# EAGLE schematic power_strip_monitor_V2 (EAGLE 6.4)

## Sheet 1 of 5: Microcontroller
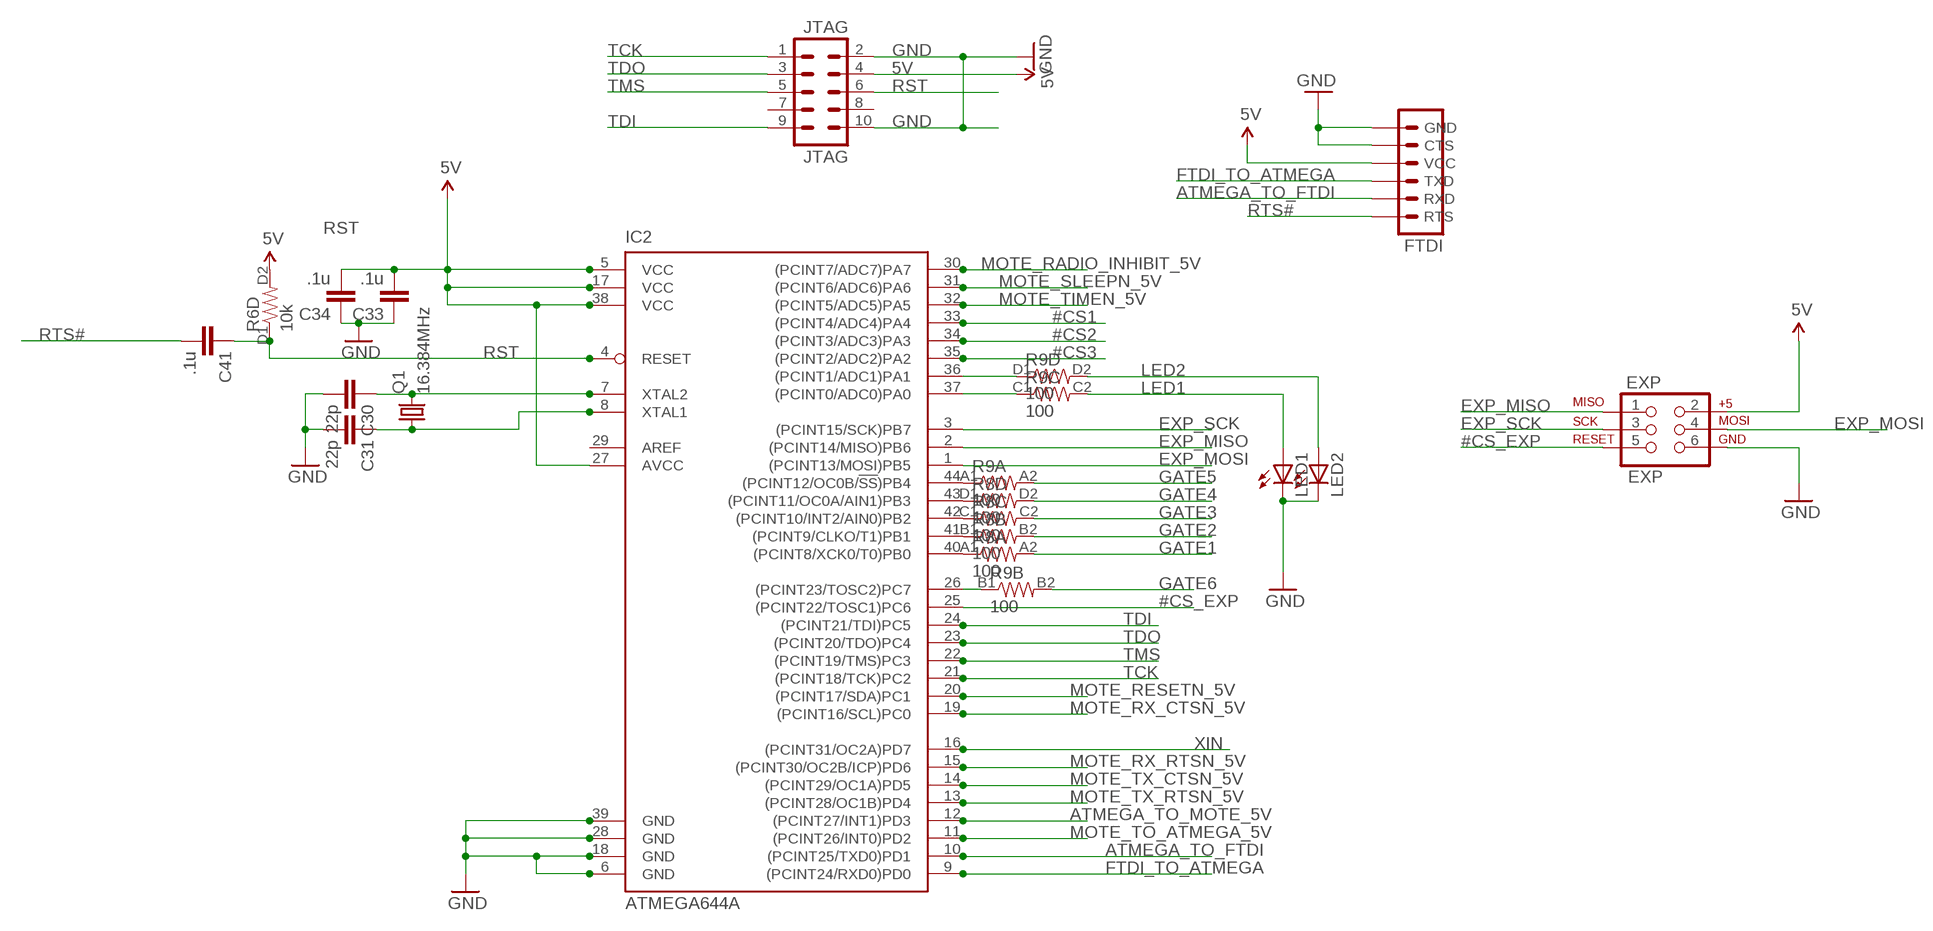
[diagram p0: schematic, sheet 1]

### Parts
C30  22p  CAP0603  [0603]
C31  22p  CAP0603  [0603]
C33  .1u  CAP0603  [0603]
C34  .1u  CAP0603  [0603]
C41  .1u  CAP0603  [0603]
EXP  EXP  AVR_SPI_PRG_6PTH  [2X3]
FTDI  FTDI_CABLESIP  [1X06]
IC2  ATMEGA644A  [TQFP44]
JTAG  JTAG  M05X2PTH  [AVR_ICSP]
LED1  LEDCHIPLED_0805  [CHIPLED_0805]
LED2  LEDCHIPLED_0805  [CHIPLED_0805]
Q1  16.384MHz  CRYSTALSMD  [HC49UP]
R6  10k  RESISTOR-ARRAY  [1206_NETWORK]
R8  100  RESISTOR-ARRAY  [1206_NETWORK]
R9  100  RESISTOR-ARRAY  [1206_NETWORK]

### Nets
5V: C33.2 C34.2 EXP.2 FTDI.3(VCC) IC2.5(VCC) IC2.17(VCC) IC2.27(AVCC) IC2.38(VCC) JTAG.4 R6.D2 ; also sheet 3,5
#CS1: IC2.33((PCINT4/ADC4)PA4) ; also sheet 3
#CS2: IC2.34((PCINT3/ADC3)PA3) ; also sheet 3
#CS3: IC2.35((PCINT2/ADC2)PA2) ; also sheet 3
#CS_EXP: EXP.5 IC2.25((PCINT22/TOSC1)PC6)
ATMEGA_TO_FTDI: FTDI.5(RXD) IC2.10((PCINT25/TXD0)PD1)
ATMEGA_TO_MOTE_5V: IC2.12((PCINT27/INT1)PD3) ; also sheet 5
EXP_MISO: EXP.1 IC2.2((PCINT14/MISO)PB6)
EXP_MOSI: EXP.4 IC2.1((PCINT13/MOSI)PB5)
EXP_SCK: EXP.3 IC2.3((PCINT15/SCK)PB7)
FTDI_TO_ATMEGA: FTDI.4(TXD) IC2.9((PCINT24/RXD0)PD0)
GATE1: R8.A2 ; also sheet 3
GATE2: R8.B2 ; also sheet 3
GATE3: R8.C2 ; also sheet 3
GATE4: R8.D2 ; also sheet 3
GATE5: R9.A2 ; also sheet 3
GATE6: R9.B2 ; also sheet 3
GND: C30.2 C31.2 C33.1 C34.1 EXP.6 FTDI.1(GND) FTDI.2(CTS) IC2.6(GND) IC2.18(GND) IC2.28(GND) IC2.39(GND) JTAG.2 JTAG.10 LED1.C LED2.C ; also sheet 2,3,4,5
LED1: LED1.A R9.C2
LED2: LED2.A R9.D2
MOTE_RADIO_INHIBIT_5V: IC2.30((PCINT7/ADC7)PA7) ; also sheet 5
MOTE_RESETN_5V: IC2.20((PCINT17/SDA)PC1) ; also sheet 5
MOTE_RX_CTSN_5V: IC2.19((PCINT16/SCL)PC0) ; also sheet 5
MOTE_RX_RTSN_5V: IC2.15((PCINT30/OC2B/ICP)PD6) ; also sheet 5
MOTE_SLEEPN_5V: IC2.31((PCINT6/ADC6)PA6) ; also sheet 5
MOTE_TIMEN_5V: IC2.32((PCINT5/ADC5)PA5) ; also sheet 5
MOTE_TO_ATMEGA_5V: IC2.11((PCINT26/INT0)PD2) ; also sheet 5
MOTE_TX_CTSN_5V: IC2.14((PCINT29/OC1A)PD5) ; also sheet 5
MOTE_TX_RTSN_5V: IC2.13((PCINT28/OC1B)PD4) ; also sheet 5
N$1: C30.1 IC2.7(XTAL2) Q1.2
N$3: C31.1 IC2.8(XTAL1) Q1.1
N$6: IC2.40((PCINT8/XCK0/T0)PB0) R8.A1
N$7: IC2.41((PCINT9/CLKO/T1)PB1) R8.B1
N$8: IC2.42((PCINT10/INT2/AIN0)PB2) R8.C1
N$10: IC2.43((PCINT11/OC0A/AIN1)PB3) R8.D1
N$12: IC2.44((PCINT12/OC0B/!SS!)PB4) R9.A1
N$13: IC2.26((PCINT23/TOSC2)PC7) R9.B1
N$14: IC2.36((PCINT1/ADC1)PA1) R9.D1
N$16: IC2.37((PCINT0/ADC0)PA0) R9.C1
RST: C41.1 IC2.4(RESET) JTAG.6 R6.D1
RTS#: C41.2 FTDI.6(RTS)
TCK: IC2.21((PCINT18/TCK)PC2) JTAG.1
TDI: IC2.24((PCINT21/TDI)PC5) JTAG.9
TDO: IC2.23((PCINT20/TDO)PC4) JTAG.3
TMS: IC2.22((PCINT19/TMS)PC3) JTAG.5
XIN: IC2.16((PCINT31/OC2A)PD7) ; also sheet 3
Unconnected: IC2.29(AREF) JTAG.7 JTAG.8

## Sheet 2 of 5: Outlets and Inlets
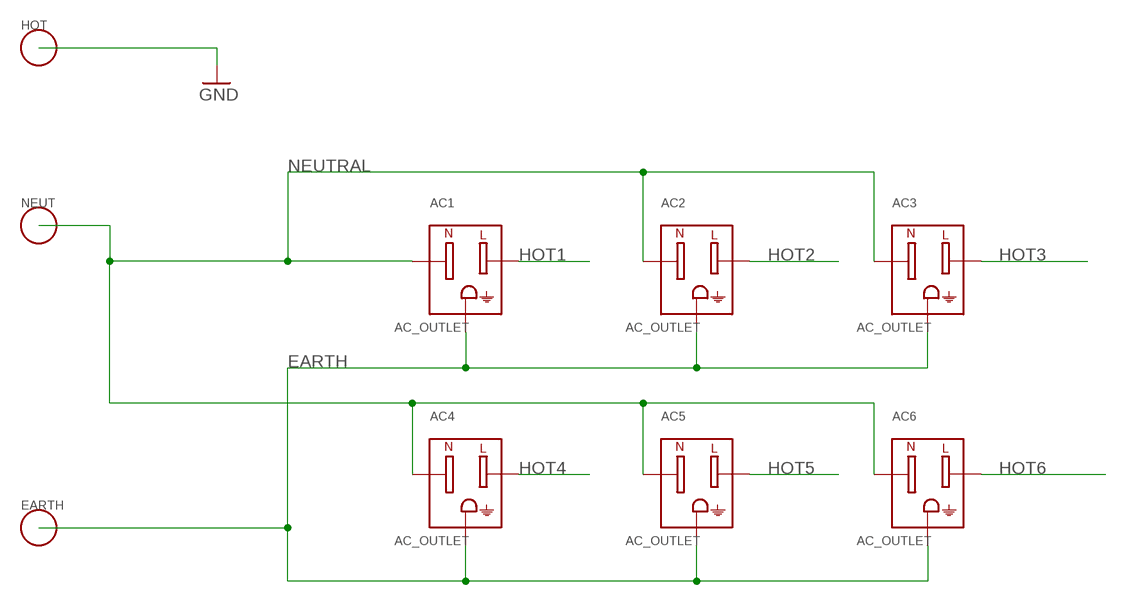
[diagram p1: schematic, sheet 2]

### Parts
AC1  AC_OUTLET  [3-213598-2]
AC2  AC_OUTLET  [3-213598-2]
AC3  AC_OUTLET  [3-213598-2]
AC4  AC_OUTLET  [3-213598-2]
AC5  AC_OUTLET  [3-213598-2]
AC6  AC_OUTLET  [3-213598-2]
EARTH  1P_HOLE  [14GAUGE_HOLE]
HOT  1P_HOLE  [14GAUGE_HOLE]
NEUT  1P_HOLE  [14GAUGE_HOLE]

### Nets
EARTH: AC1.3(EARTH) AC2.3(EARTH) AC3.3(EARTH) AC4.3(EARTH) AC5.3(EARTH) AC6.3(EARTH) EARTH.P$1
GND: HOT.P$1 ; also sheet 1,3,4,5
HOT1: AC1.2(L) ; also sheet 3
HOT2: AC2.2(L) ; also sheet 3
HOT3: AC3.2(L) ; also sheet 3
HOT4: AC4.2(L) ; also sheet 3
HOT5: AC5.2(L) ; also sheet 3
HOT6: AC6.2(L) ; also sheet 3
NEUTRAL [Evil_AC]: AC1.1(N) AC2.1(N) AC3.1(N) AC4.1(N) AC5.1(N) AC6.1(N) NEUT.P$1 ; also sheet 3,5

## Sheet 3 of 5: Current Sensors
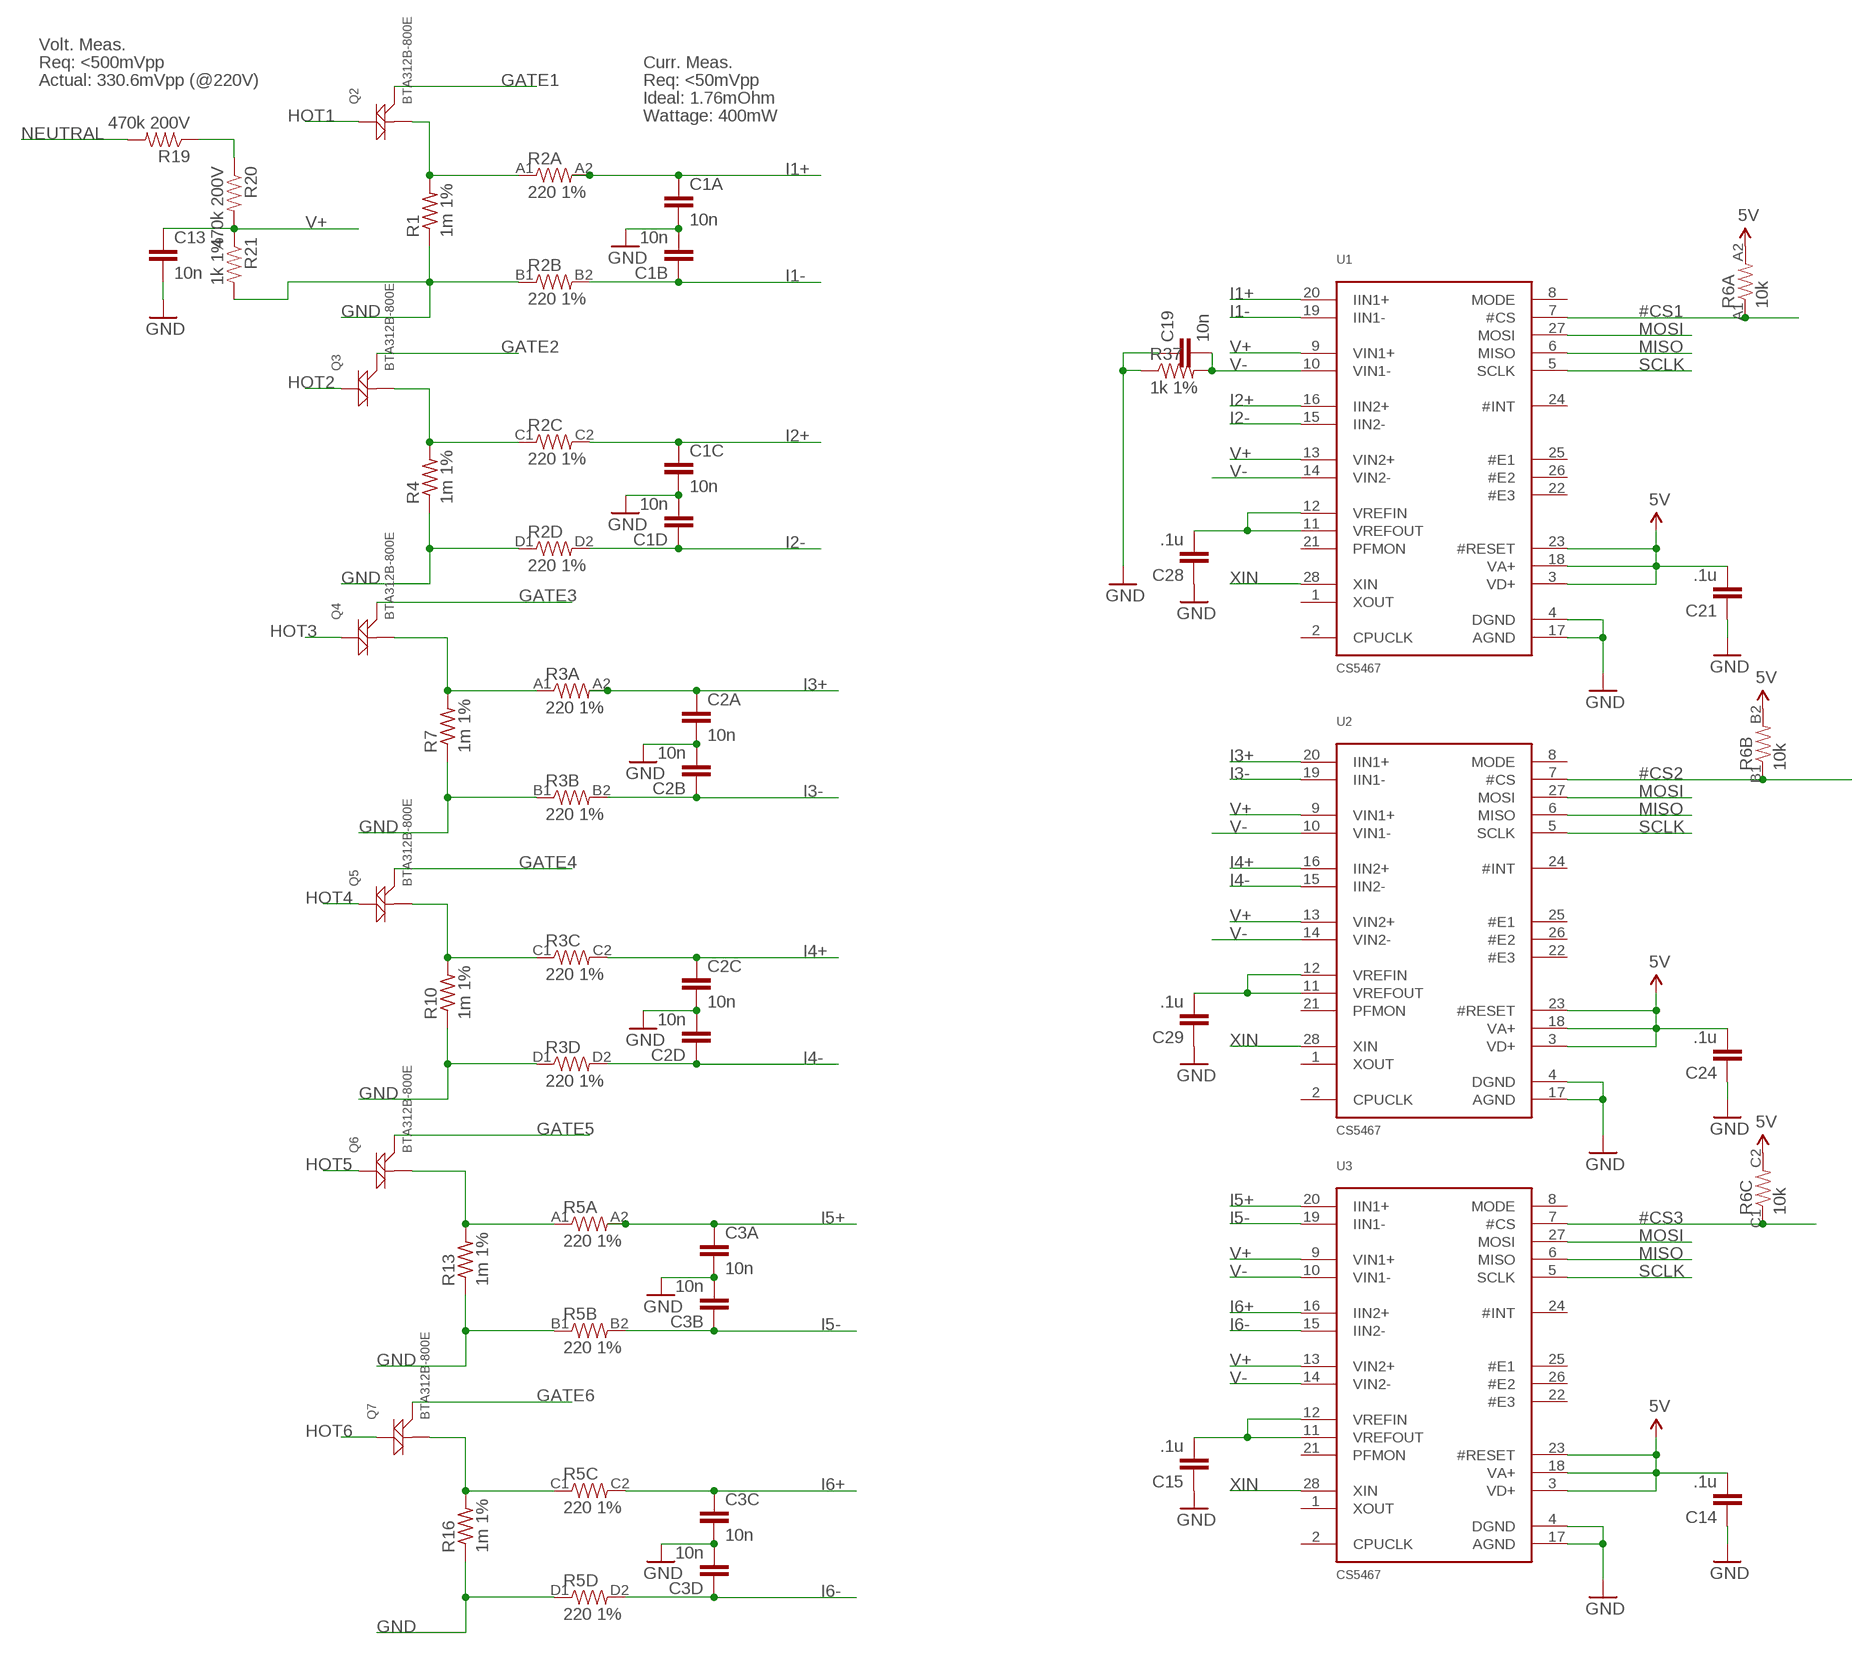
[diagram p2: schematic, sheet 3]

### Parts
C1  10n  CAP_ARRAY  [1206_NETWORK]
C2  10n  CAP_ARRAY  [1206_NETWORK]
C3  10n  CAP_ARRAY  [1206_NETWORK]
C13  10n  CAP0603  [0603]
C14  .1u  CAP0603  [0603]
C15  .1u  CAP0603  [0603]
C19  10n  CAP0603  [0603]
C21  .1u  CAP0603  [0603]
C24  .1u  CAP0603  [0603]
C28  .1u  CAP0603  [0603]
C29  .1u  CAP0603  [0603]
Q2  BTA312B-800E  TRIACD2PACK  [D2PACK_NXP]
Q3  BTA312B-800E  TRIACD2PACK  [D2PACK_NXP]
Q4  BTA312B-800E  TRIACD2PACK  [D2PACK_NXP]
Q5  BTA312B-800E  TRIACD2PACK  [D2PACK_NXP]
Q6  BTA312B-800E  TRIACD2PACK  [D2PACK_NXP]
Q7  BTA312B-800E  TRIACD2PACK  [D2PACK_NXP]
R1  1m 1%  R-US_R2512  [R2512]
R2  220 1%  RESISTOR-ARRAY  [1206_NETWORK]
R3  220 1%  RESISTOR-ARRAY  [1206_NETWORK]
R4  1m 1%  R-US_R2512  [R2512]
R5  220 1%  RESISTOR-ARRAY  [1206_NETWORK]
R7  1m 1%  R-US_R2512  [R2512]
R10  1m 1%  R-US_R2512  [R2512]
R13  1m 1%  R-US_R2512  [R2512]
R16  1m 1%  R-US_R2512  [R2512]
R19  470k 200V  RESISTOR1206  [1206]
R20  470k 200V  RESISTOR1206  [1206]
R21  1k 1%  RESISTOR0603  [0603]
R37  1k 1%  RESISTOR0603  [0603]
U1  CS5467  [SSOP28L_CIRRUS]
U2  CS5467  [SSOP28L_CIRRUS]
U3  CS5467  [SSOP28L_CIRRUS]

### Nets
5V: C14.2 C21.2 C24.2 R6.A2 R6.B2 R6.C2 U1.3(VD+) U1.18(VA+) U1.23(#RESET) U2.3(VD+) U2.18(VA+) U2.23(#RESET) U3.3(VD+) U3.18(VA+) U3.23(#RESET) ; also sheet 1,5
#CS1: R6.A1 U1.7(#CS) ; also sheet 1
#CS2: R6.B1 U2.7(#CS) ; also sheet 1
#CS3: R6.C1 U3.7(#CS) ; also sheet 1
GATE1: Q2.3(G) ; also sheet 1
GATE2: Q3.3(G) ; also sheet 1
GATE3: Q4.3(G) ; also sheet 1
GATE4: Q5.3(G) ; also sheet 1
GATE5: Q6.3(G) ; also sheet 1
GATE6: Q7.3(G) ; also sheet 1
GND: C1.A2 C1.B2 C1.C2 C1.D2 C2.A2 C2.B2 C2.C2 C2.D2 C3.A2 C3.B2 C3.C2 C3.D2 C13.2 C14.1 C15.1 C19.1 C21.1 C24.1 C28.1 C29.1 R1.1 R2.B1 R2.D1 R3.B1 R3.D1 R4.1 R5.B1 R5.D1 R7.1 R10.1 R13.1 R16.1 R21.2 R37.1 U1.4(DGND) U1.17(AGND) U2.4(DGND) U2.17(AGND) U3.4(DGND) U3.17(AGND) ; also sheet 1,2,4,5
HOT1: Q2.2(M2) ; also sheet 2
HOT2: Q3.2(M2) ; also sheet 2
HOT3: Q4.2(M2) ; also sheet 2
HOT4: Q5.2(M2) ; also sheet 2
HOT5: Q6.2(M2) ; also sheet 2
HOT6: Q7.2(M2) ; also sheet 2
HRET1: Q2.1(M1) R1.2 R2.A1
HRET2: Q3.1(M1) R2.C1 R4.2
HRET3: Q4.1(M1) R3.A1 R7.2
HRET4: Q5.1(M1) R3.C1 R10.2
HRET5: Q6.1(M1) R5.A1 R13.2
HRET6: Q7.1(M1) R5.C1 R16.2
I1+: C1.A1 R2.A2 U1.20(IIN1+)
I1-: C1.B1 R2.B2 U1.19(IIN1-)
I2+: C1.C1 R2.C2 U1.16(IIN2+)
I2-: C1.D1 R2.D2 U1.15(IIN2-)
I3+: C2.A1 R3.A2 U2.20(IIN1+)
I3-: C2.B1 R3.B2 U2.19(IIN1-)
I4+: C2.C1 R3.C2 U2.16(IIN2+)
I4-: C2.D1 R3.D2 U2.15(IIN2-)
I5+: C3.A1 R5.A2 U3.20(IIN1+)
I5-: C3.B1 R5.B2 U3.19(IIN1-)
I6+: C3.C1 R5.C2 U3.16(IIN2+)
I6-: C3.D1 R5.D2 U3.15(IIN2-)
MISO: U1.6(MISO) U2.6(MISO) U3.6(MISO)
MOSI: U1.27(MOSI) U2.27(MOSI) U3.27(MOSI)
N$2: R19.1 R20.1
N$4: C15.2 U3.11(VREFOUT) U3.12(VREFIN)
N$11: C29.2 U2.11(VREFOUT) U2.12(VREFIN)
N$15: C28.2 U1.11(VREFOUT) U1.12(VREFIN)
NEUTRAL [Evil_AC]: R19.2 ; also sheet 2,5
SCLK: U1.5(SCLK) U2.5(SCLK) U3.5(SCLK)
V+: C13.1 R20.2 R21.1 U1.9(VIN1+) U1.13(VIN2+) U2.9(VIN1+) U2.13(VIN2+) U3.9(VIN1+) U3.13(VIN2+)
V-: C19.2 R37.2 U1.10(VIN1-) U1.14(VIN2-) U2.10(VIN1-) U2.14(VIN2-) U3.10(VIN1-) U3.14(VIN2-)
XIN: U1.28(XIN) U2.28(XIN) U3.28(XIN) ; also sheet 1
Unconnected: U1.1(XOUT) U1.2(CPUCLK) U1.8(MODE) U1.21(PFMON) U1.22(#E3) U1.24(#INT) U1.25(#E1) U1.26(#E2) U2.1(XOUT) U2.2(CPUCLK) U2.8(MODE) U2.21(PFMON) U2.22(#E3) U2.24(#INT) U2.25(#E1) U2.26(#E2) U3.1(XOUT) U3.2(CPUCLK) U3.8(MODE) U3.21(PFMON) U3.22(#E3) U3.24(#INT) U3.25(#E1) U3.26(#E2)

### Notes on the sheet
- Volt. Meas.
- Req: <500mVpp | Curr. Meas.
- Actual: 330.6mVpp (@220V) | Req: <50mVpp
- Ideal: 1.76mOhm
- Wattage: 400mW

## Sheet 4 of 5: Communication
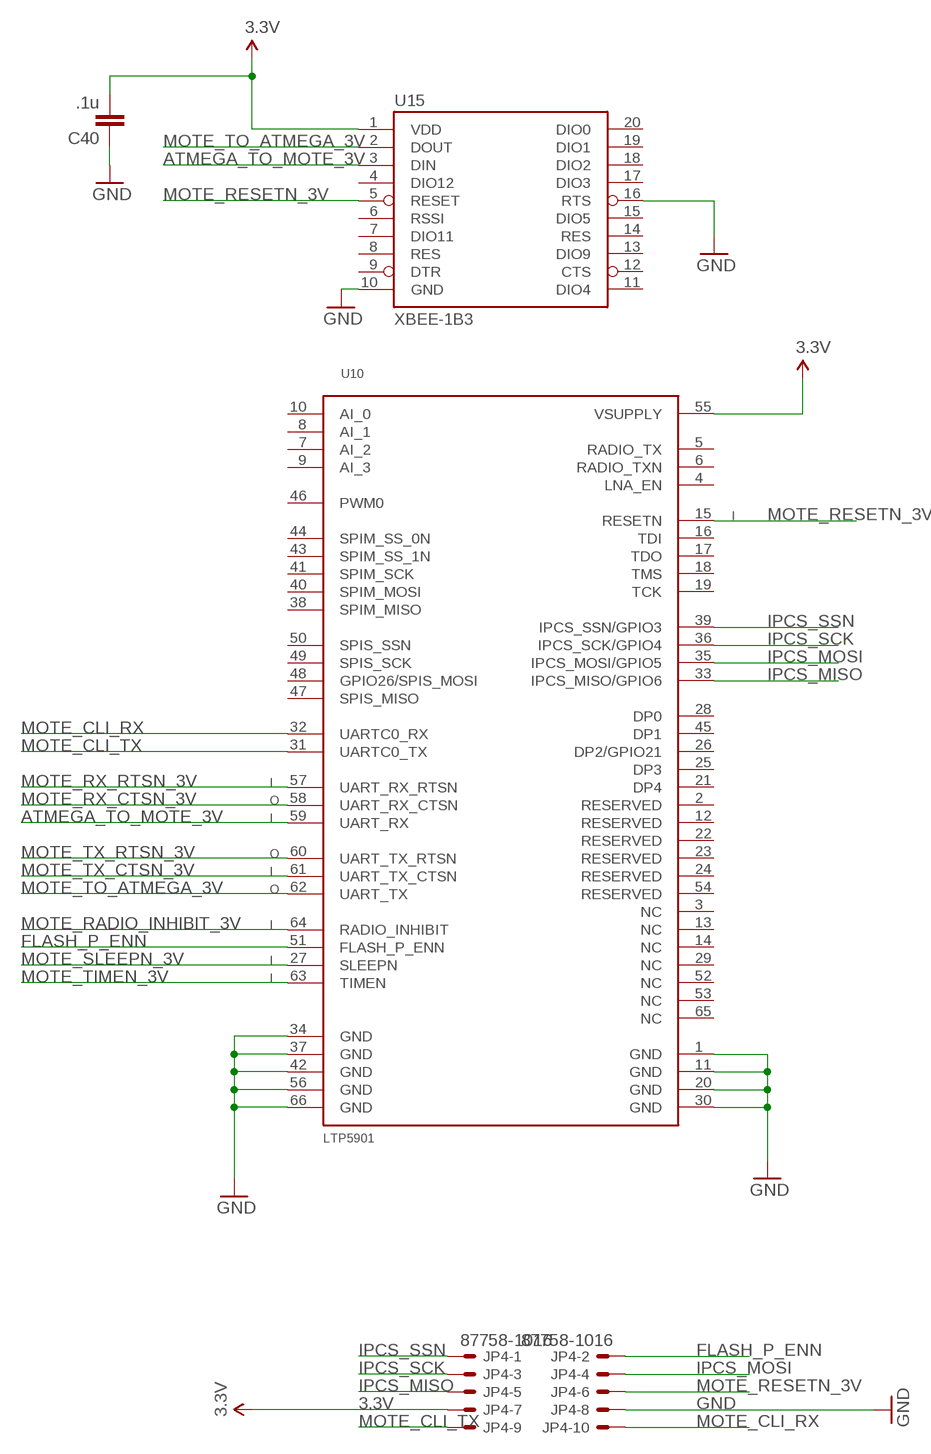
[diagram p3: schematic, sheet 4]

### Parts
C40  .1u  CAP0603  [0603]
JP4  87758-1016  [87758-1016]
U10  LTP5901  [LTP5901_MODULE]
U15  XBEE-1B3  [XBEE-SMD]

### Nets
3.3V: C40.2 JP4.7 U10.55(VSUPPLY) U15.1(VDD) ; also sheet 5
ATMEGA_TO_MOTE_3V: U10.59(UART_RX) U15.3(DIN) ; also sheet 5
FLASH_P_ENN: JP4.2 U10.51(FLASH_P_ENN)
GND: C40.1 JP4.8 U10.1(GND) U10.11(GND) U10.20(GND) U10.30(GND) U10.34(GND) U10.37(GND) U10.42(GND) U10.56(GND) U10.66(GND) U15.10(GND) U15.16(RTS) ; also sheet 1,2,3,5
IPCS_MISO: JP4.5 U10.33(IPCS_MISO/GPIO6)
IPCS_MOSI: JP4.4 U10.35(IPCS_MOSI/GPIO5)
IPCS_SCK: JP4.3 U10.36(IPCS_SCK/GPIO4)
IPCS_SSN: JP4.1 U10.39(IPCS_SSN/GPIO3)
MOTE_CLI_RX: JP4.10 U10.32(UARTC0_RX)
MOTE_CLI_TX: JP4.9 U10.31(UARTC0_TX)
MOTE_RADIO_INHIBIT_3V: U10.64(RADIO_INHIBIT) ; also sheet 5
MOTE_RESETN_3V: JP4.6 U10.15(RESETN) U15.5(RESET) ; also sheet 5
MOTE_RX_CTSN_3V: U10.58(UART_RX_CTSN) ; also sheet 5
MOTE_RX_RTSN_3V: U10.57(UART_RX_RTSN) ; also sheet 5
MOTE_SLEEPN_3V: U10.27(SLEEPN) ; also sheet 5
MOTE_TIMEN_3V: U10.63(TIMEN) ; also sheet 5
MOTE_TO_ATMEGA_3V: U10.62(UART_TX) U15.2(DOUT) ; also sheet 5
MOTE_TX_CTSN_3V: U10.61(UART_TX_CTSN) ; also sheet 5
MOTE_TX_RTSN_3V: U10.60(UART_TX_RTSN) ; also sheet 5
Unconnected: U10.2(RESERVED) U10.3(NC) U10.4(LNA_EN) U10.5(RADIO_TX) U10.6(RADIO_TXN) U10.7(AI_2) U10.8(AI_1) U10.9(AI_3) U10.10(AI_0) U10.12(RESERVED) U10.13(NC) U10.14(NC) U10.16(TDI) U10.17(TDO) U10.18(TMS) U10.19(TCK) U10.21(DP4) U10.22(RESERVED) U10.23(RESERVED) U10.24(RESERVED) U10.25(DP3) U10.26(DP2/GPIO21) U10.28(DP0) U10.29(NC) U10.38(SPIM_MISO) U10.40(SPIM_MOSI) U10.41(SPIM_SCK) U10.43(SPIM_SS_1N) U10.44(SPIM_SS_0N) U10.45(DP1) U10.46(PWM0) U10.47(SPIS_MISO) U10.48(GPIO26/SPIS_MOSI) U10.49(SPIS_SCK) U10.50(SPIS_SSN) U10.52(NC) U10.53(NC) U10.54(RESERVED) U10.65(NC) U15.4(DIO12) U15.6(RSSI) U15.7(DIO11) U15.8(RES) U15.9(DTR) U15.11(DIO4) U15.12(CTS) U15.13(DIO9) U15.14(RES) U15.15(DIO5) U15.17(DIO3) U15.18(DIO2) U15.19(DIO1) U15.20(DIO0)

### Notes on the sheet
- I
- I
- O
- I
- O
- I
- O
- I
- I
- I

## Sheet 5 of 5: Power & Level Translation
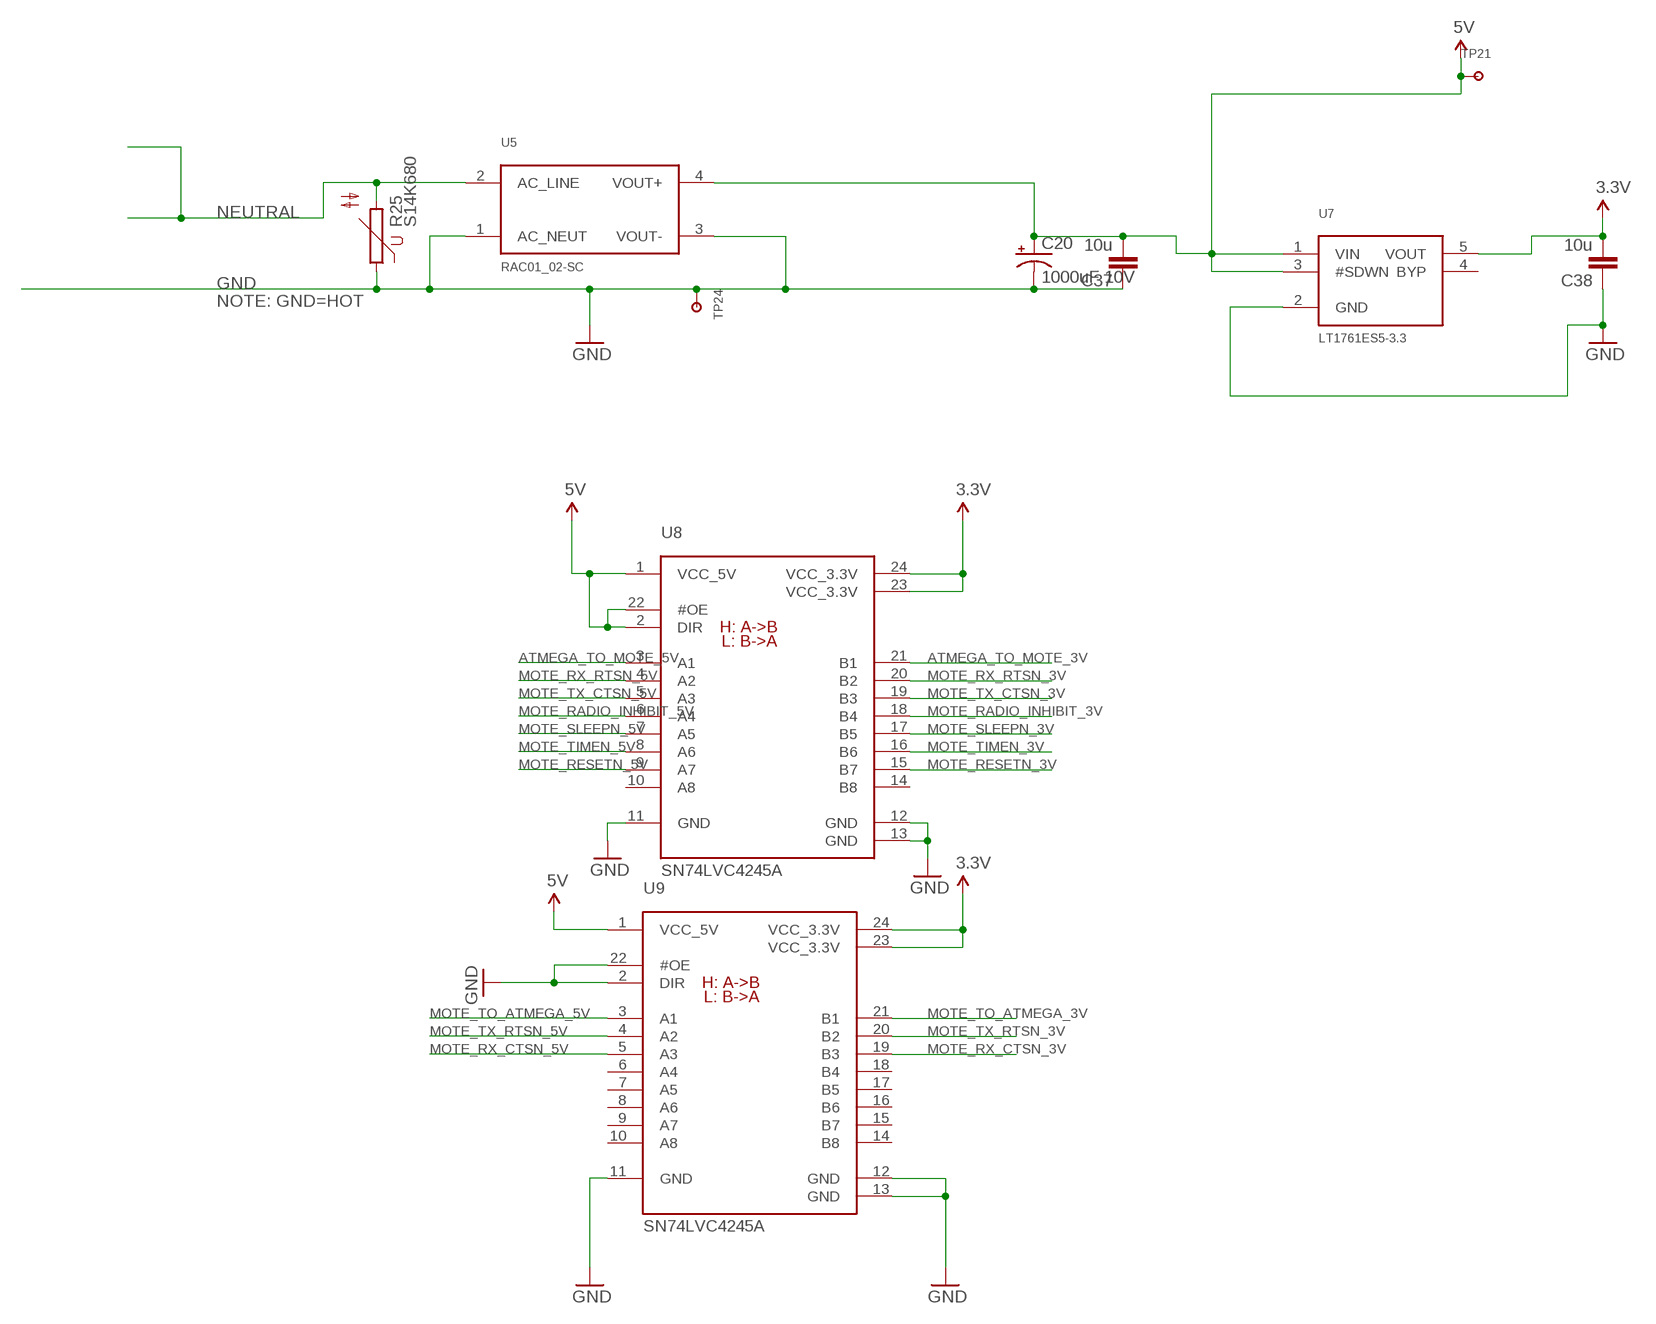
[diagram p4: schematic, sheet 5]

### Parts
C20  1000uF 10V  CAP_POLPTH3  [CPOL-RADIAL-1000UF-63V]
C37  10u  CAP0603  [0603]
C38  10u  CAP0603  [0603]
R25  S14K680  [S14K680]
TP21  TESTPOINT100MIL  [TESTPOINT-100MIL]
TP24  TESTPOINT100MIL  [TESTPOINT-100MIL]
U5  RAC01_02-SC  [RAC01_02-SC]
U7  LT1761ES5-3.3  LT1761-X  [TSOT23-5_LINEAR]
U8  SN74LVC4245A  SN74VC4245A  [TSSOP24_TI]
U9  SN74LVC4245A  SN74VC4245A  [TSSOP24_TI]

### Nets
3.3V: C38.2 U7.5(VOUT) U8.23(VCC_3.3V) U8.24(VCC_3.3V) U9.23(VCC_3.3V) U9.24(VCC_3.3V) ; also sheet 4
5V: C20.1(+) C37.2 TP21.2 U5.4(VOUT+) U7.1(VIN) U7.3(#SDWN) U8.1(VCC_5V) U8.2(DIR) U8.22(#OE) U9.1(VCC_5V) ; also sheet 1,3
ATMEGA_TO_MOTE_3V: U8.21(B1) ; also sheet 4
ATMEGA_TO_MOTE_5V: U8.3(A1) ; also sheet 1
GND: C20.2(-) C37.1 C38.1 R25.1 TP24.2 U5.1(AC_NEUT) U5.3(VOUT-) U7.2(GND) U8.11(GND) U8.12(GND) U8.13(GND) U9.2(DIR) U9.11(GND) U9.12(GND) U9.13(GND) U9.22(#OE) ; also sheet 1,2,3,4
MOTE_RADIO_INHIBIT_3V: U8.18(B4) ; also sheet 4
MOTE_RADIO_INHIBIT_5V: U8.6(A4) ; also sheet 1
MOTE_RESETN_3V: U8.15(B7) ; also sheet 4
MOTE_RESETN_5V: U8.9(A7) ; also sheet 1
MOTE_RX_CTSN_3V: U9.19(B3) ; also sheet 4
MOTE_RX_CTSN_5V: U9.5(A3) ; also sheet 1
MOTE_RX_RTSN_3V: U8.20(B2) ; also sheet 4
MOTE_RX_RTSN_5V: U8.4(A2) ; also sheet 1
MOTE_SLEEPN_3V: U8.17(B5) ; also sheet 4
MOTE_SLEEPN_5V: U8.7(A5) ; also sheet 1
MOTE_TIMEN_3V: U8.16(B6) ; also sheet 4
MOTE_TIMEN_5V: U8.8(A6) ; also sheet 1
MOTE_TO_ATMEGA_3V: U9.21(B1) ; also sheet 4
MOTE_TO_ATMEGA_5V: U9.3(A1) ; also sheet 1
MOTE_TX_CTSN_3V: U8.19(B3) ; also sheet 4
MOTE_TX_CTSN_5V: U8.5(A3) ; also sheet 1
MOTE_TX_RTSN_3V: U9.20(B2) ; also sheet 4
MOTE_TX_RTSN_5V: U9.4(A2) ; also sheet 1
NEUTRAL [Evil_AC]: R25.2 U5.2(AC_LINE) ; also sheet 2,3
Unconnected: U7.4(BYP) U8.10(A8) U8.14(B8) U9.6(A4) U9.7(A5) U9.8(A6) U9.9(A7) U9.10(A8) U9.14(B8) U9.15(B7) U9.16(B6) U9.17(B5) U9.18(B4)

### Notes on the sheet
- NOTE: GND=HOT

## Library data of the parts
AC1-AC6 = Cool_Electricity:AC_OUTLET
C1-C3 = Cool_Electricity:CAP_ARRAY
C13-C15 C19 C21 C24 C28-C31 C33 C34 C37 C38 C40 C41 = SparkFun:CAP: Capacitor Standard 0603 ceramic capacitor, and 0.1" leaded capacitor.
C20 = SparkFun-Passives:CAP_POL: Capacitor Polarized These are standard SMD and PTH capacitors. Normally 10uF, 47uF, and 100uF in electrolytic and tantalum varieties. Always verify the external diameter of the through hole cap, it varies with capacity, voltage, and manufacturer. The EIA devices should be standard.
EARTH HOT NEUT = Cool_Electricity:1P_HOLE
EXP = SparkFun-Connectors:AVR_SPI_PRG_6: AVR ISP 6 Pin This is the reduced ISP connector for AVR programming. Common on Arduino. This footprint will take up less PCB space and can be used with a 10-pin to 6-pin adapter such as SKU: BOB-08508
FTDI = custom:FTDI_CABLE: Header 6 Standard 6-pin 0.1" header. Use with straight break away headers (SKU : PRT-00116), right angle break away headers (PRT-00553), swiss pins (PRT-00743), machine pins (PRT-00117), and female headers (PRT-00115). Molex polarized connector foot print use with SKU : PRT-08094 with associated crimp pins and housings. NOTES ON THE VARIANTS LOCK and LOCK_LONGPADS... This footprint was designed to help hold the alignment of a through-hole component (i.e. 6-pin header) while soldering it into place. You may notice that each hole has been shifted either up or down by 0.005 of an inch from it's more standard position (which is a perfectly straight line). This slight alteration caused the pins (the squares in the middle) to touch the edges of the holes. Because they are alternating, it causes a "brace" to hold the component in place. 0.005 has proven to be the perfect amount of "off-center" position when using our standard breakaway headers. Although looks a little odd when you look at the bare footprint, once you have a header in there, the alteration is very hard to notice. Also, if you push a header all the way into place, it is covered up entirely on the bottom side. This idea of altering the position of holes to aid alignment will be further integrated into the Sparkfun Library for other footprints. It can help hold any component with 3 or more connection pins.
IC2 = atmel:ATMEGA644: 8-bit Microcontroller with 64K Bytes In-System Programmable Flash Source: http://www.atmel.com/dyn/resources/prod_documents/doc2593.pdf; MPN: ATMEGA644PV-10AU; OC_FARNELL: 1455123; OC_NEWARK: 58M3748
JP4 = con-molex:87758-1016: 10 Pin - 2mm Dual Row Single Wafer, Vertical T/H HDR Source: http://www.molex.com/pdm_docs/sd/877580616_sd.pdf; MF: MOLEX; MPN: 87758-1016; OC_FARNELL: 7472340; OC_NEWARK: 59J1558
JTAG = SparkFun-Connectors:M05X2: Header 5x2 Standard 10-pin dual row 0.1" header. Commonly used with AVR-ISP. Use with Spark Fun Electronics SKU: PRT-00778
LED1 LED2 = led:LED: LED OSRAM: - CHIPLED LG R971, LG N971, LY N971, LG Q971, LY Q971, LO R971, LY R971 LH N974, LH R974 LS Q976, LO Q976, LY Q976 LO Q996 - Hyper CHIPLED LW Q18S LB Q993, LB Q99A, LB R99A - SideLED LS A670, LO A670, LY A670, LG A670, LP A670 LB A673, LV A673, LT A673, LW A673 LH A674 LY A675 LS A676, LA A676, LO A676, LY A676, LW A676 LS A679, LY A679, LG A679 - Hyper Micro SIDELED® LS Y876, LA Y876, LO Y876, LY Y876 LT Y87S - SmartLED LW L88C, LW L88S LB L89C, LB L89S, LG L890 LS L89K, LO L89K, LY L89K LS L896, LA L896, LO L896, LY L896 - TOPLED LS T670, LO T670, LY T670, LG T670, LP T670 LSG T670, LSP T670, LSY T670, LOP T670, LYG T670 LG T671, LOG T671, LSG T671 LB T673, LV T673, LT T673, LW T673 LH T674 LS T676, LA T676, LO T676, LY T676, LB T676, LH T676, LSB T676, LW T676 LB T67C, LV T67C, LT T67C, LS T67K, LO T67K, LY T67K, LW E67C LS E67B, LA E67B, LO E67B, LY E67B, LB E67C, LV E67C, LT E67C LW T67C LS T679, LY T679, LG T679 LS T770, LO T770, LY T770, LG T770, LP T770 LB T773, LV T773, LT T773, LW T773 LH T774 LS E675, LA E675, LY E675, LS T675 LS T776, LA T776, LO T776, LY T776, LB T776 LHGB T686 LT T68C, LB T68C - Hyper Mini TOPLED® LB M676 - Mini TOPLED Santana® LG M470 LS M47K, LO M47K, LY M47K Source: http://www.osram.convergy.de LUXEON: - LUMILED® LXK2-PW12-R00, LXK2-PW12-S00, LXK2-PW14-U00, LXK2-PW14-V00 LXK2-PM12-R00, LXK2-PM12-S00, LXK2-PM14-U00 LXK2-PE12-Q00, LXK2-PE12-R00, LXK2-PE12-S00, LXK2-PE14-T00, LXK2-PE14-U00 LXK2-PB12-K00, LXK2-PB12-L00, LXK2-PB12-M00, LXK2-PB14-N00, LXK2-PB14-P00, LXK2-PB14-Q00 LXK2-PR12-L00, LXK2-PR12-M00, LXK2-PR14-Q00, LXK2-PR14-R00 LXK2-PD12-Q00, LXK2-PD12-R00, LXK2-PD12-S00 LXK2-PH12-R00, LXK2-PH12-S00 LXK2-PL12-P00, LXK2-PL12-Q00, LXK2-PL12-R00 Source: www.luxeon.com KINGBRIGHT: KA-3528ASYC Source: www.kingbright.com
Q1 = SparkFun:CRYSTAL: Crystals Various standard crystals. Proven footprints. Spark Fun Electronics SKU : COM-00534
Q2-Q7 = Cool_Electricity:TRIAC: Low-power generic TRIAC packages
R1 R4 R7 R10 R13 R16 = rcl:R-US_: RESISTOR, American symbol
R2 R3 R5 R6 R8 R9 = Cool_Electricity:RESISTOR-ARRAY: Array Chip Resistor Source: RS Component / Phycomp
R19-R21 R37 = SparkFun:RESISTOR: Resistor Basic schematic elements and footprints for 0603, 1206, and PTH 1/10th watt (small) resistors.
R25 = varistor:S14K680: VARISTOR
TP21 TP24 = WSNlib:TESTPOINT: Generic Testpoint
U1-U3 = Cool_Electricity:CS5467: CS5467 Power monitoring chip
U5 = Cool_Electricity:RAC01_02-SC: RAC_01_02-SC AC/DC converter 1W 5V out
U7 = Cool_Electricity:LT1761-X: LT1761-X LDO Voltage Regulator
U8 U9 = Cool_Electricity:SN74VC4245A
U10 = Cool_Electricity:LTP5901: LTP5901
U15 = SparkFun-RF:XBEE-1: Xbee module footprints SMT header is CONN-09042.; PROD_ID: CONN-09042

## Net classes
0 default: width 0.203 mm, drill 0.381 mm, clearance 0.203 mm
1 Evil_AC: width 0.254 mm, drill 0.381 mm, clearance 2.997 mm